# EAGLE schematic StdBx Proto Board(ALPHA) (EAGLE 6.6.0)
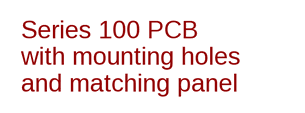
[diagram p0: schematic, sheet 1]

## Parts
U$1  SERIES_100"  [SERIES_100]

## Library data of the parts
U$1 = StdBxLibrary:SERIES_100: Circuit board outline sized and with mounting that will fit the Series 100 line of StdBx enclosures. Components from the StdBx library include information that combined with this component will export a DXF file to create the end panel for the enclosure.